# EAGLE schematic cto5kmate (EAGLE 7.1.0)
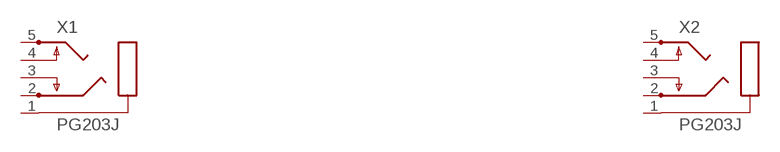
[diagram p0: schematic, sheet 1]

## Parts
X1  PG203J  [PG203J]
X2  PG203J  [PG203J]
Unconnected: X1.1 X1.2 X1.3 X1.4 X1.5 X2.1 X2.2 X2.3 X2.4 X2.5

## Library data of the parts
X1 X2 = con-hirschmann:PG203J: MIC/HEADPHONE JACK KS-S stereo microphone/headphone jack PG203JN (Schukat); OC_FARNELL: unknown; OC_NEWARK: unknown